# Altium schematic sheet Sheet1.SchDoc
size A4
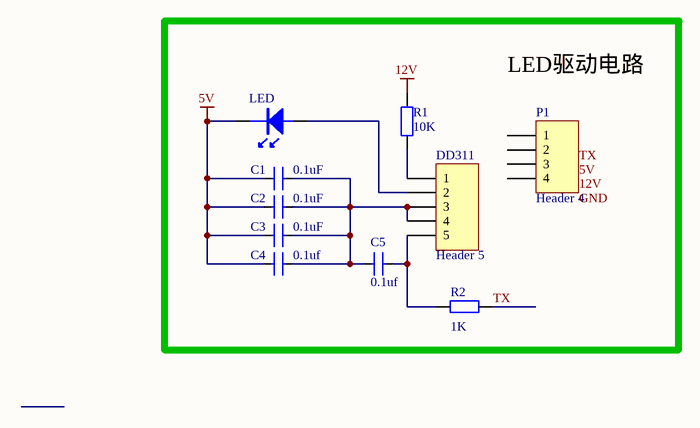
[diagram p0: Sheet1.SchDoc]

## Parts
C1  0.1uF  [0805C]
C2  0.1uF  [0805C]
C3  0.1uF  [0805C]
C4  0.1uf  [0805C]
C5  0.1uf  [0805C]
DD311  Header 5  [DD311]
LED  D-LED  [led]  (value not drawn)
P1  Header 4  [HDR1X4]
R1  value 10K  [0805]  (hidden comment: Res2)
R2  value 1K  [0805]  (hidden comment: Res2)

## Blocks framed on the sheet
LED驱动电路: C1-C5 DD311 LED P1 R1 R2

## Nets
5V: C1.1 C2.1 C3.1 C4.1 LED.K
12V: R1.2
TX: R2.2
NetC1_2: C1.2 C2.2 C3.2 C4.2 C5.1 DD311.3 DD311.4
NetC5_2: C5.2 DD311.5 R2.1
NetDD311_1: DD311.1 R1.1
NetDD311_2: DD311.2 LED.A

Not connected (* = marked no-connect by the designer): P1 1 2 3 4

## Notes on the sheet
- Labels drawn without touching a wire or pin: 5V, 12V, GND, TX

## Library data of the parts
C1-C5 = C_0.1uF: SMD-CAP
DD311 = Header 5: Header, 5-Pin; LatestRevisionDate: 17-Jul-2002; LatestRevisionNote: Re-released for DXP Platform.; Publisher: Altium Limited
LED = D-LED: LED
P1 = Header 4: Header, 4-Pin; LatestRevisionDate: 17-Jul-2002; LatestRevisionNote: Re-released for DXP Platform.; Publisher: Altium Limited
R1 R2 = Res2: Resistor; Published: 8-Jun-2000; LatestRevisionDate: 17-Jul-2002; LatestRevisionNote: Re-released for DXP Platform.; PackageReference: AXIAL-0.4; Publisher: Altium Limited; PackageDescription: Axial Device, Thru-Hole; 2 Leads; 0.4 in Pin Spacing